# EasyEDA Pro project ProDoc_AI-Light-PCB_2025-12-01.epro

# Board AI-Light-PCB
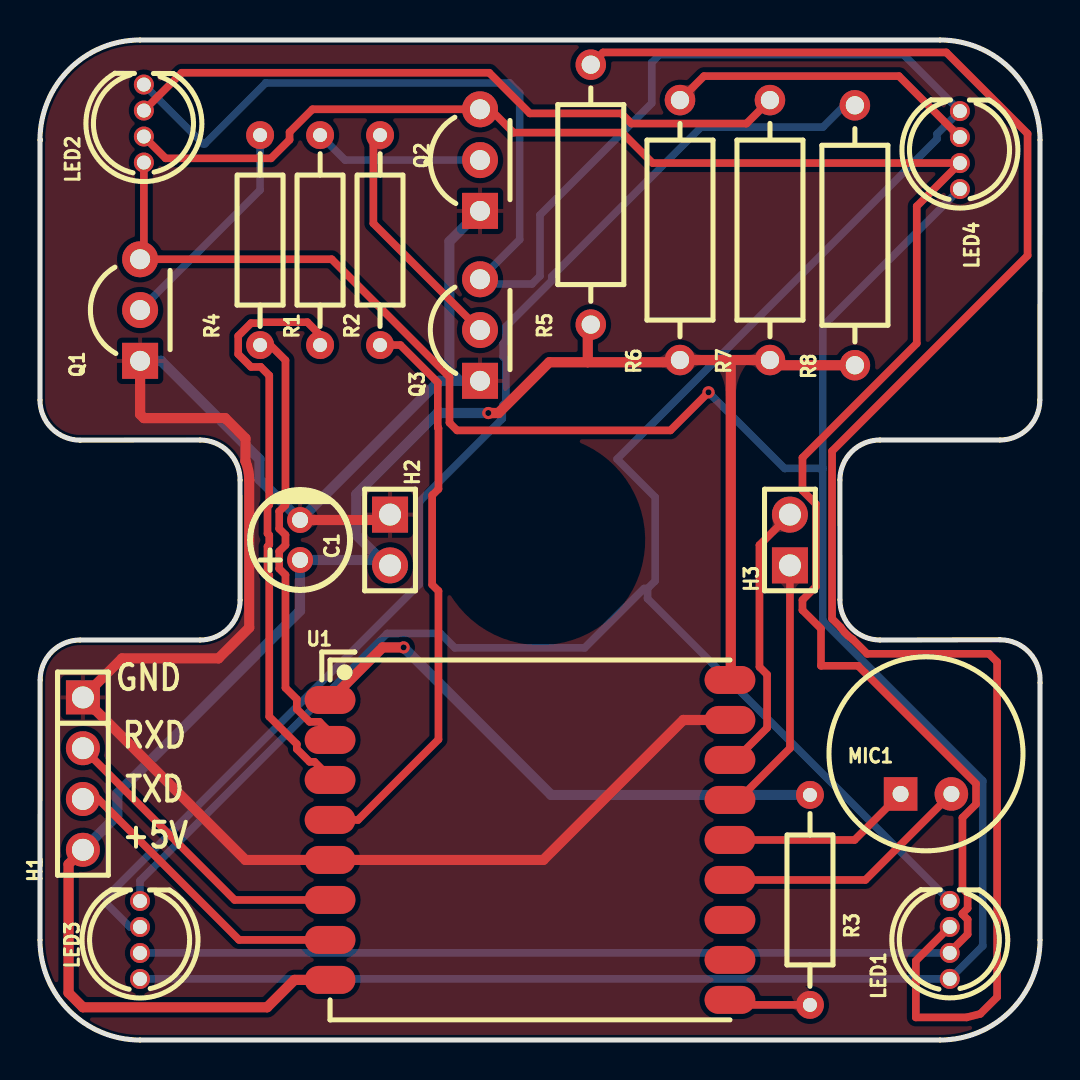
[diagram p0: board, top side]
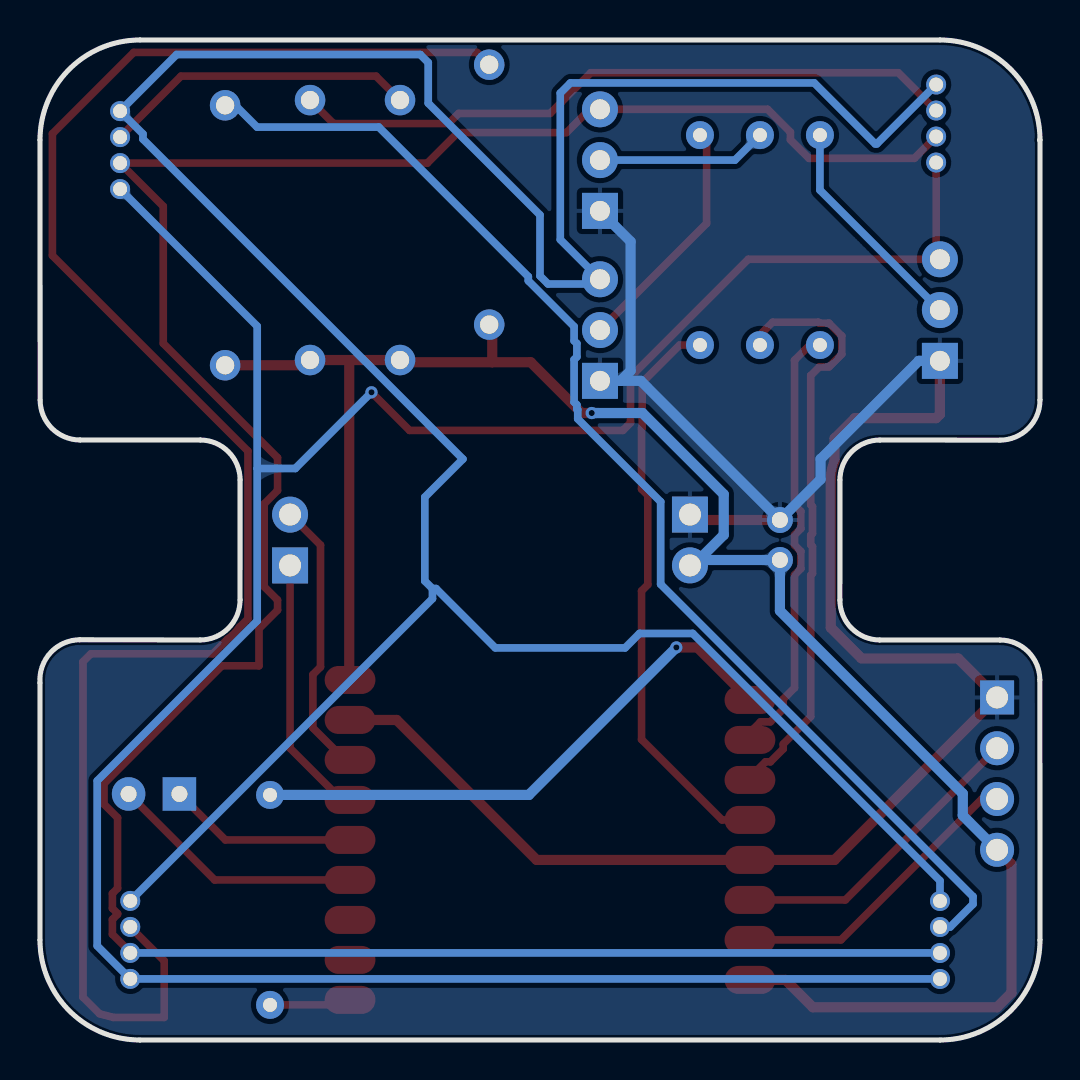
[diagram p1: board, bottom side, seen from below]

Outline 50.01 x 50.01 mm; copper layers: Top Layer, Bottom Layer. Coordinates in mm from the lower left corner of the outline.
Outline path: 0.02,45.03 arc(0.02,45.02) 0.03,45.01 ; 0,45.01 0,32.01 arc(0.59,30.59) 2.01,30 8.01,30.01 arc(9.42,29.42) 10.01,28 10.01,22.01 arc(9.42,20.59) 8.01,20 2.01,20 arc(0.59,19.42) 0.01,18.01 0,5 arc(1.46,1.46) 5,0 45.01,0 arc(48.55,1.46) 50.01,5 50.01,17.86 arc(49.48,19.38) 48.01,20.02 42.01,20.01 arc(40.59,20.59) 40.01,22.01 40.01,28.01 arc(40.59,29.42) 42.01,30.01 48.01,30.01 arc(49.42,30.59) 50.01,32.01 50.01,45.01 arc(48.55,48.55) 45.01,50.01 5,50.01 arc(1.46,48.55) 0,45.01
Stack: Top Layer 0.035mm / Dielectric1 1.51mm FR4 er 4.5 / Bottom Layer 0.035mm

## Design rules (mm)
template: 自定义配置
spacing copperThickness1oz (default): track to track 0.203, other pairs 0.203 to 0.203
spacing copperThickness2oz: track to track 0.203, other pairs 0.152 to 0.3
track width copperThickness1oz (default): min 0.254, default 0.381, max 0.508
track width copperThickness2oz: min 0.203, default 0.254, max 2.54
track width VCC and GND: min 0.254, default 0.508, max 0.508
differential pair differentialPair (default): width min 0.127, default 0.254, max 2.54; gap min 0.152, default 0.152
via viaSize (default): diameter min 0.5, default 0.61, max 10; hole min 0.3, default 0.305, max 6.3
net +5V uses VCC and GND
net GND uses VCC and GND
net 3.3V uses VCC and GND

## Placement (name value [footprint] x y rotation side)
C1  100uF  [CAP-TH_BD5.0-P2.00-D0.8-FD]  13.01 25.01 90 top
H1  B-2100S04P-A110  [HDR-TH_4P-P2.54-V-M]  2.15 13.32 270 top
H2  B-2100S02P-A110  [HDR-TH_2P-P2.54-V-M-1]  17.51 25.01 270 top
H3  B-2100S02P-A110  [HDR-TH_2P-P2.54-V-M-1]  37.51 25.01 90 top
LED1  TJ-L5FCMXHTCYLCRGB-A5  [LED-TH_4P-BD5.8-P1.30]  45.5 5.01 90 top
LED2  TJ-L5FCMXHTCYLCRGB-A5  [LED-TH_4P-BD5.8-P1.30]  5.19 45.83 90 top
LED3  TJ-L5FCMXHTCYLCRGB-A5  [LED-TH_4P-BD5.8-P1.30]  5 5 90 top
LED4  TJ-L5FCMXHTCYLCRGB-A5  [LED-TH_4P-BD5.8-P1.30]  46.01 44.51 90 top
MIC1  GMI9767P-32DB  [MIC-TH_BD9.7-P2.54-D0.8-L-FD]  44.31 12.31 0 top
Q1  SS8050-TA(RANGE:160-300)  [TO-92-3_L4.8-W3.7-P2.54-L]  5.01 36.51 90 top
Q2  SS8050-TA(RANGE:160-300)  [TO-92-3_L4.8-W3.7-P2.54-L]  22.01 44.01 90 top
Q3  SS8050-TA(RANGE:160-300)  [TO-92-3_L4.8-W3.7-P2.54-L]  22.01 35.51 90 top
R1  4.7kΩ  [RES-TH_BD2.3-L6.5-P10.50-D0.5]  14.01 40.01 90 top
R2  4.7kΩ  [RES-TH_BD2.3-L6.5-P10.50-D0.5]  17.01 40.01 90 top
R3  4.7kΩ  [RES-TH_BD2.3-L6.5-P10.50-D0.5]  38.51 7.01 90 top
R4  4.7kΩ  [RES-TH_BD2.3-L6.5-P10.50-D0.5]  11.01 40.01 90 top
R5  100Ω  [RES-TH_BD3.3-L9.0-P13.00-D0.6]  27.55 42.28 90 top
R6  100Ω  [RES-TH_BD3.3-L9.0-P13.00-D0.6]  32.01 40.51 90 top
R7  100Ω  [RES-TH_BD3.3-L9.0-P13.00-D0.6]  36.51 40.51 90 top
R8  100Ω  [RES-TH_BD3.3-L9.0-P13.00-D0.6]  40.75 40.25 90 top
U1  CI-C22GS02S  [SMD-17_L20.0-W1.80-CI-C22GS02S]  24.51 10.01 0 top

## Footprints (pads in the part's own frame, mm; a bottom-side part is the same pattern mirrored in y, then rotated)
CAP-TH_BD5.0-P2.00-D0.8-FD
  round 1.3 hole 0.8: 1(-1,0) 2(1,0)
HDR-TH_2P-P2.54-V-M-1
  rect 1.8x1.8 hole 1.1: 1(-1.27,0)
  round 1.8 hole 1.1: 2(1.27,0)
HDR-TH_4P-P2.54-V-M
  rect 1.7x1.7 hole 1.1: 1(-3.81,0)
  round 1.7 hole 1.1: 2(-1.27,0) 3(1.27,0) 4(3.81,0)
LED-TH_4P-BD5.8-P1.30
  round 1 hole 0.7: 1(1.95,0) 2(0.65,0) 3(-0.65,0) 4(-1.95,0)
MIC-TH_BD9.7-P2.54-D0.8-L-FD
  rect 1.677x1.677 hole 0.8: 1(-1.27,0)
  round 1.677 hole 0.8: 2(1.27,0)
RES-TH_BD2.3-L6.5-P10.50-D0.5
  round 1.4 hole 0.7: 1(-5.25,0) 2(5.25,0)
RES-TH_BD3.3-L9.0-P13.00-D0.6
  round 1.524 hole 0.914: 1(-6.5,0) 2(6.5,0)
SMD-17_L20.0-W1.80-CI-C22GS02S
  oval 2.54x1.4 smd: 1(-10,7) 2(-10,5) 3(-10,3) 4(-10,1) 5(-10,-1) 6(-10,-3) 7(-10,-5) 8(-10,-7) 9(10,-8) 10(10,-6) 11(10,-4) 12(10,-2) 13(10,0) 14(10,2) 15(10,4) 16(10,6) 17(10,8)
TO-92-3_L4.8-W3.7-P2.54-L
  rect 1.8x1.8 hole 1: 1(-2.54,0)
  round 1.8 hole 1: 2(0,0) 3(2.54,0)

## Nets
3.3V: R3.2 U1.1
+5V: C1.1 H1.4 H2.2 R5.1 R6.1 R7.1 R8.1 U1.8 U1.17
GND: C1.2 H1.1 H2.1 Q1.1 Q2.1 Q3.1 U1.5 U1.16
MICL+: MIC1.1 U1.13
MICL-: MIC1.2 U1.12
PWM3: R4.1 U1.2
PWM4: R1.1 U1.3
PWM5: R2.1 U1.4
RXD: H1.2 U1.6
SPKL+: H3.2 U1.15
SPKL-: H3.1 U1.14
TXD: H1.3 U1.7
$1N639: LED1.2 R5.2
$1N1634: R3.1 U1.9
$1N1900: LED4.2 R6.2
$1N1902: LED2.2 R7.2
$1N1904: LED3.2 R8.2
$1N1908: Q1.2 R4.2
$1N1920: LED1.4 LED2.4 LED3.4 LED4.4 Q1.3
$1N1972: Q2.2 R1.2
$1N2028: LED1.3 LED2.3 LED3.3 LED4.3 Q2.3
$1N2078: Q3.2 R2.2
$1N2107: LED1.1 LED2.1 LED3.1 LED4.1 Q3.3

Pads without a net: U1 10 11

## Via types
v1: diameter 0.61, hole 0.305, Top Layer to Bottom Layer, 3 vias

## Routing (per net, layer and track width the routed paths; a pad name or vN(x,y) marks a point on that pad's centre or on a via; arc(x,y) is an arc through that point)
3.3V: length 28.1
  Top Layer w0.508: v1(18.19,19.63) 17.13,19.63 U1.1
  Bottom Layer w0.508: v1(18.19,19.63) 25.56,12.26 R3.2
+5V: length 94.6
  Top Layer w0.508: U1.8 12.73,3.01 11.36,1.64 2.15,1.64 1.43,2.36 1.43,8.79 H1.4 ; v1(22.42,31.36) 22.93,31.36 25.47,33.9 27.4,33.9 ; 27.4,33.9 31.9,33.9 R6.1 34.55,34.01 ; 27.4,33.9 27.4,35.63 R5.1 ; 34.55,34.01 34.55,18.05 U1.17 ; 34.55,34.01 R7.1 36.77,33.75 R8.1
  Bottom Layer w0.508: 17.07,24.01 17.34,23.74 H2.2 ; 17.07,24.01 15.82,25.26 15.82,27.29 19.88,31.36 v1(22.42,31.36) ; 17.07,24.01 C1.1 13.01,21.47 3.86,12.32 3.86,11.23 H1.4
GND: length 104.1
  Top Layer w0.508: Q1.1 5.01,31.29 5.19,31.1 9.26,31.1 10.27,30.09 10.27,28.95 arc(10.42,28.49) 10.46,28 10.46,20.62 8.93,19.09 4.1,19.09 H1.1 10.27,9.01 U1.5 25.17,9.01 32.17,16.01 U1.16 ; C1.2 17.24,26.01 H2.1
  Bottom Layer w0.508: 20.98,32.97 19.97,32.97 C1.2 10.97,28.04 10.97,29.05 6.06,33.97 Q1.1 ; 20.98,32.97 Q3.1 ; 20.98,32.97 20.47,33.47 20.47,39.93 Q2.1
MICL+: length 9.5
  Top Layer w0.381: MIC1.1 40.74,10.01 U1.13
MICL-: length 12.9
  Top Layer w0.381: MIC1.2 41.28,8.01 U1.12
PWM3: length 22.3
  Top Layer w0.381: U1.2 14.51,15.38 13.98,15.91 13.48,15.91 12.84,16.55 12.84,17.05 12.28,17.61 12.28,23.26 11.96,23.57 11.96,24.44 12.28,24.75 12.28,25.26 11.96,25.57 11.96,26.44 12.28,26.75 12.28,33.99 11.51,34.76 R4.1
PWM4: length 29.8
  Top Layer w0.381: R1.1 14.01,35.26 13.37,35.9 11.09,35.9 11.04,35.85 10.55,35.85 9.91,35.21 9.91,34.3 10.55,33.66 11.04,33.66 11.47,33.23 11.47,26.77 11.38,26.68 11.38,25.33 11.47,25.24 11.47,24.77 11.38,24.68 11.38,23.33 11.47,23.24 11.47,16.17 12.84,14.8 12.84,14.55 13.48,13.91 13.73,13.91 14.51,13.13 U1.3
PWM5: length 28.9
  Top Layer w0.381: R2.1 18.02,34.76 19.9,32.88 19.9,30.63 19.93,30.6 19.93,27.56 19.61,27.24 19.61,22.77 19.93,22.46 19.93,15.03 15.9,11.01 U1.4
RXD: length 15.5
  Top Layer w0.381: H1.2 9.73,7.01 U1.6
SPKL+: length 14
  Top Layer w0.381: U1.15 34.76,14.01 36.36,15.61 36.36,18.28 35.98,18.66 35.98,24.75 H3.2
SPKL-: length 13.2
  Top Layer w0.381: U1.14 34.81,12.31 35.22,12.31 37.51,14.59 H3.1
TXD: length 15.3
  Top Layer w0.381: U1.7 9.95,5.01 2.91,12.05 H1.3
$1N639: length 87.7
  Top Layer w0.381: LED1.2 43.8,3.96 43.8,1.13 46.34,1.13 47.03,1.31 47.87,2.15 47.87,18.91 47.46,19.31 41.37,19.31 40.64,20.04 arc(40.31,20.31) 40.04,20.64 39.61,21.07 39.61,29.45 49.39,39.23 49.39,45.33 45.33,49.39 28.16,49.39 R5.2
$1N1634: length 4.1
  Top Layer w0.381: R3.1 34.76,1.76 U1.9
$1N1900: length 15.8
  Top Layer w0.381: R6.2 33.2,48.2 42.96,48.2 LED4.2
$1N1902: length 33.6
  Top Layer w0.381: LED2.2 7.08,48.37 22.47,48.37 24.5,46.34 29.07,46.34 29.58,45.83 35.33,45.83 R7.2
$1N1904: length 61.5
  Bottom Layer w0.381: LED3.2 4.49,5.65 3.35,6.79 3.35,7.18 18.97,22.8 18.97,26.92 23.12,31.07 23.12,31.52 23.16,31.56 23.16,31.77 23.3,31.9 23.3,34.03 23.16,34.17 23.16,34.83 23.3,34.97 23.3,35.68 25.59,37.97 25.59,38.18 33.07,45.66 39.16,45.66 40.25,46.75 R8.2
$1N1908: length 11.2
  Bottom Layer w0.381: Q1.2 11.01,42.51 R4.2
$1N1920: length 133.1
  Top Layer w0.381: v1(33.43,32.39) 31.53,30.49 20.86,30.49 20.48,30.87 20.48,33.16 14.59,39.05 Q1.3 5.19,39.23 LED2.4
  Bottom Layer w0.381: 39.15,28.58 39.15,20.96 47.15,12.96 47.15,4.71 LED1.4 5.01,3.06 ; 39.15,28.58 39.15,35.7 LED4.4 ; 39.15,28.58 37.24,28.58 v1(33.43,32.39)
$1N1972: length 8.5
  Bottom Layer w0.381: Q2.2 15.26,44.01 R1.2
$1N2028: length 133.1
  Top Layer w0.381: LED2.3 6.28,44.09 11.55,44.09 12.48,45.02 12.48,45.4 13.62,46.55 Q2.3 22.51,46.55 23.68,45.38 29.12,45.38 30.64,43.86 LED4.3 43.85,41.7 43.85,34.84 38.13,29.12 38.13,27.48 38.8,26.81 38.8,22.67 38.13,22.01 38.13,21.5 39.06,20.57 39.06,18.72 40.91,18.72 46.81,12.82 46.81,11.8 46.13,11.12 46.13,7.59 46.39,7.33 46.39,6.59 46.13,6.33 46.13,6.29 46.39,6.03 46.39,5.29 45.5,4.39 LED1.3
  Bottom Layer w0.381: LED1.3 5.01,4.36
$1N2078: length 12.1
  Top Layer w0.381: R2.2 16.67,44.92 16.67,40.84 Q3.2
$1N2107: length 151.5
  Bottom Layer w0.381: 30.39,22.58 30.39,22.07 LED1.1 ; 30.39,22.58 30.77,22.96 30.77,27.15 28.86,29.05 44.86,45.06 44.86,45.31 LED4.1 43.18,49.29 31,49.29 30.59,48.88 30.59,46.85 25.01,41.26 25.01,38.21 24.6,37.81 22.24,37.81 Q3.3 23.99,40.03 23.99,47.36 23.48,47.87 11.29,47.87 8.24,44.82 8.16,44.82 LED2.1 ; 30.39,22.58 30.21,22.58 27.24,19.61 20.75,19.61 20.03,20.33 17.37,20.33 5,7.97 LED3.1

## Copper pours and planes (outline as drawn; the poured copper is in the pictures)
GND on Top Layer: -1.92,50.91 51.42,50.91 51.42,-0.39 -1.92,-0.39
GND on Bottom Layer: -1.41,51.42 51.42,51.42 51.42,-1.41 -1.41,-1.41

Small or netless copper shapes (teardrops, artwork), in the pictures only: 13 on Top Layer, 10 on Bottom Layer

## Text on the board
Top Silkscreen Layer: GND | RXD | +5V | TXD
